# Altium schematic sheet uC.SchDoc: uC
size A3; SheetNumber: 3; SheetTotal: 4
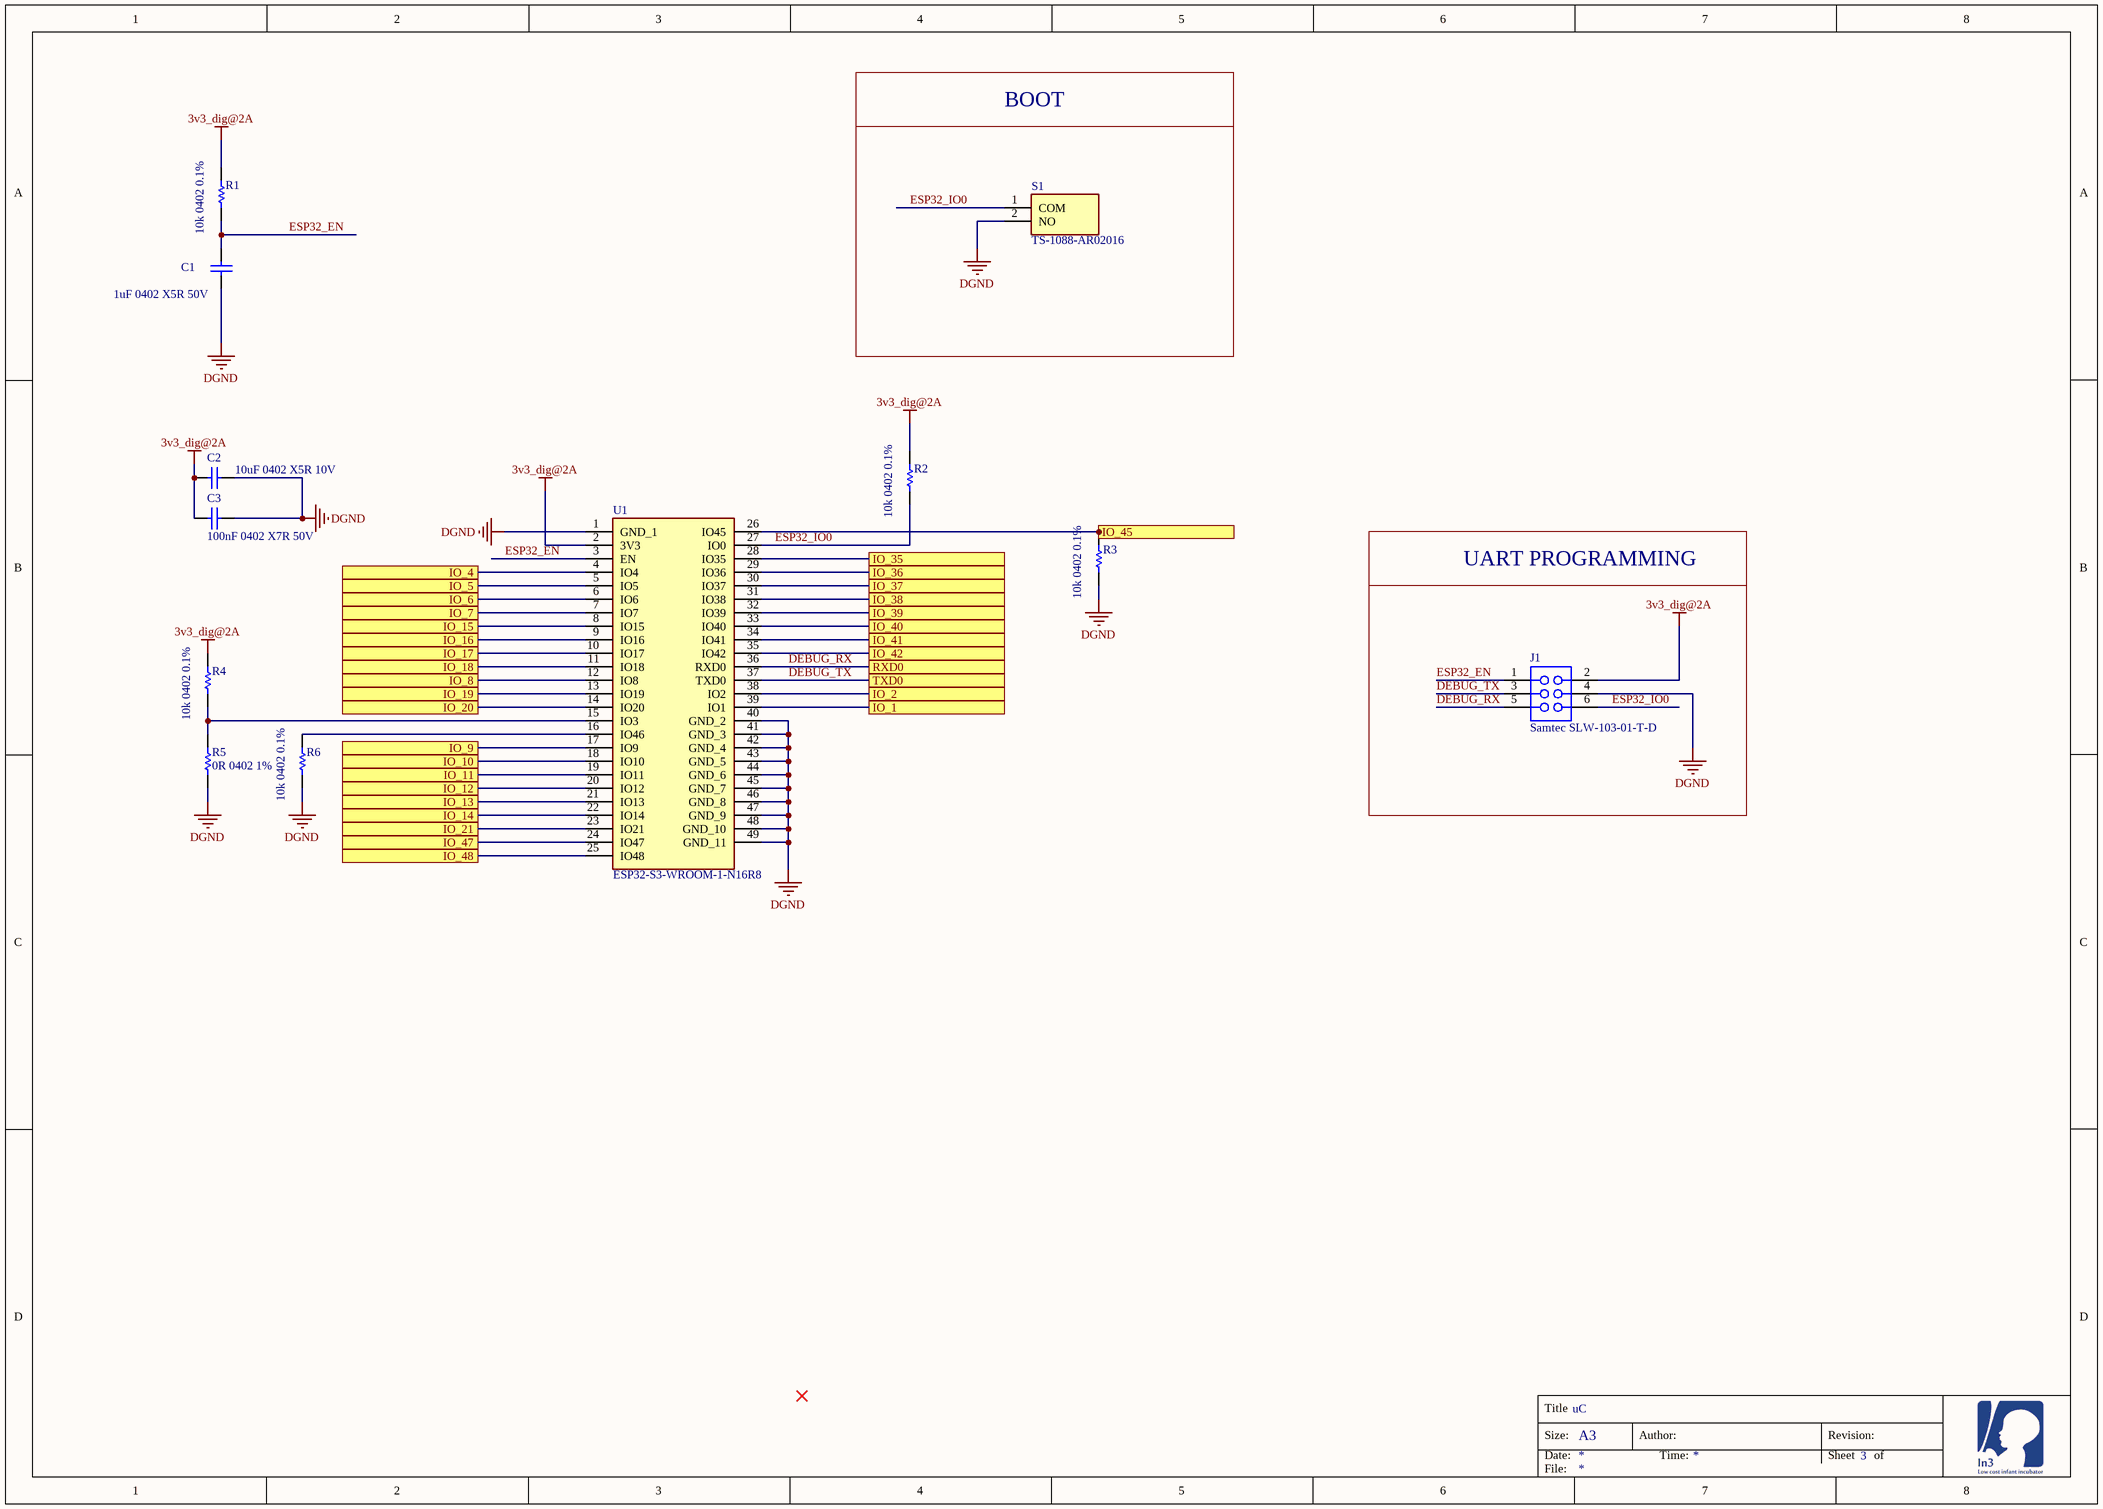
[diagram p0: uC.SchDoc]

## Parts
C1  1uF 0402 X5R 50V  [CAPC1005X55X25NL5T10]
C2  10uF 0402 X5R 10V  [CAPC1005X55X25NL5T10]
C3  100nF 0402 X7R 50V  [CAPC1005X55X25NL5T10]
J1  Samtec SLW-103-01-T-D  [PCB-37z8hw1ej4f71bosen9e-1]
R1  10k 0402 0.1%  [RESC1005X40X25ML05T10]
R2  10k 0402 0.1%  [RESC1005X40X25ML05T10]
R3  10k 0402 0.1%  [RESC1005X40X25ML05T10]
R4  10k 0402 0.1%  [RESC1005X40X25ML05T10]
R5  0R 0402 1%  [RESC1005X40X25ML05T10]
R6  10k 0402 0.1%  [RESC1005X40X25ML05T10]
S1  TS-1088-AR02016  [TS1088AR02016]
U1  ESP32-S3-WROOM-1-N16R8  [ESP32S3WROOM1N16R8]

## Blocks framed on the sheet
BOOT: S1
UART PROGRAMMING: J1

## Ports
IO_1, IO_2, IO_4, IO_5, IO_6, IO_7, IO_8, IO_9, IO_10, IO_11, IO_12, IO_13, IO_14, IO_15, IO_16, IO_17, IO_18, IO_19, IO_20, IO_21, IO_35, IO_36, IO_37, IO_38, IO_39, IO_40, IO_41, IO_42, IO_45, IO_47, IO_48, RXD0, TXD0

## Nets
3v3_dig@2A: C2.2 C3.2 J1.2 R1.2 R2.2 R4.2 U1.2(3V3)
DGND: C1.1 C2.1 C3.1 J1.4 R3.1 R5.2 R6.1 S1.2(NO) U1.1(GND_1) U1.40(GND_2) U1.41(GND_3) U1.42(GND_4) U1.43(GND_5) U1.44(GND_6) U1.45(GND_7) U1.46(GND_8) U1.47(GND_9) U1.48(GND_10) U1.49(GND_11)
DEBUG_RX: J1.5 U1.36(RXD0) ; port RXD0
DEBUG_TX: J1.3 U1.37(TXD0) ; port TXD0
ESP32_EN: C1.2 J1.1 R1.1 U1.3(EN)
ESP32_IO0: J1.6 R2.1 S1.1(COM) U1.27(IO0)
IO_1: U1.39(IO1) ; port IO_1
IO_2: U1.38(IO2) ; port IO_2
IO_4: U1.4(IO4) ; port IO_4
IO_5: U1.5(IO5) ; port IO_5
IO_6: U1.6(IO6) ; port IO_6
IO_7: U1.7(IO7) ; port IO_7
IO_8: U1.12(IO8) ; port IO_8
IO_9: U1.17(IO9) ; port IO_9
IO_10: U1.18(IO10) ; port IO_10
IO_11: U1.19(IO11) ; port IO_11
IO_12: U1.20(IO12) ; port IO_12
IO_13: U1.21(IO13) ; port IO_13
IO_14: U1.22(IO14) ; port IO_14
IO_15: U1.8(IO15) ; port IO_15
IO_16: U1.9(IO16) ; port IO_16
IO_17: U1.10(IO17) ; port IO_17
IO_18: U1.11(IO18) ; port IO_18
IO_19: U1.13(IO19) ; port IO_19
IO_20: U1.14(IO20) ; port IO_20
IO_21: U1.23(IO21) ; port IO_21
IO_35: U1.28(IO35) ; port IO_35
IO_36: U1.29(IO36) ; port IO_36
IO_37: U1.30(IO37) ; port IO_37
IO_38: U1.31(IO38) ; port IO_38
IO_39: U1.32(IO39) ; port IO_39
IO_40: U1.33(IO40) ; port IO_40
IO_41: U1.34(IO41) ; port IO_41
IO_42: U1.35(IO42) ; port IO_42
IO_45: R3.2 U1.26(IO45) ; port IO_45
IO_47: U1.24(IO47) ; port IO_47
IO_48: U1.25(IO48) ; port IO_48
NetR4_1: R4.1 R5.1 U1.15(IO3)
NetR6_2: R6.2 U1.16(IO46)

## Notes on the sheet
- Title
- Size:
- Date:
- A3
- Author:
- Time:
- Revision:
- Sheet
- of
- File:

## Library data of the parts
C1-C3 = CMP-1662-00020-1: ComponentLink2Description: Datasheet; ComponentLink2URL: http://psearch.en.murata.com/capacitor/product/GRM155R60J105KE19%23.pdf; ComponentLink1Description: Manufacturer URL; ComponentLink1URL: http://www.murata.com/
  C1: LCSC_PN: C1518208
  C2: LCSC_PN: C77000
  C3: LCSC_PN: C77020
J1 = CMP-bcf575fbeff46332-1: Dual Row Connector Female Samtec SLW-103-01-T-D; Lead-Free Status: Lead Free; Number of Contacts: 6; Pin Pitch: 2.54 mm; Voltage Rating (AC): 400 V; Gender: Female; Color: Black; Octopart URL: https://octopart.com/slw-103-01-t-d-samtec-292455; Mounting Style: Through Hole, Vertical; Contact Plating: Tin; OctopartID: bcf575fbeff46332; Operating Temperature: 105 °C (max); Size-Width: 4.95 mm; Housing Material: Plastic; Size-Length: 7.62 mm; Number of Rows: 2; Size-Height: 4.57 mm; Packaging: Tube; RoHS: Compliant; Contact Material: Phosphor Bronze; Number of Positions: 6; Housing Color: Black; REACH SVHC Compliance: No SVHC; Manufacturer Part Number: SLW-103-01-T-D; LCSC_PN: C492420
R1-R6 = CMP-2002-07472-1
  R1-R4 R6: LCSC_PN: C190095
  R5: LCSC_PN: C60485
S1 = TS-1088-AR02016: Switch; Manufacturer_Name: XUNPU; Datasheet Link: https://www.xunpudianzi.com/uploads/pdf/TS-1088-ARXXX.pdf; Height: 2mm; Manufacturer_Part_Number: TS-1088-AR02016; LCSC_PN: C720477
U1 = ESP32-S3-WROOM-1-N16R8: Integrated Circuit; Manufacturer_Name: Espressif Systems; Datasheet Link: https://www.espressif.com/sites/default/files/documentation/esp32-s3-wroom-1_wroom-1u_datasheet_en.pdf; Height: 3.25mm; Manufacturer_Part_Number: ESP32-S3-WROOM-1-N16R8; Mouser Part Number: 356-ESP32S3WRM1N16R8; Mouser Price/Stock: https://www.mouser.co.uk/ProductDetail/Espressif-Systems/ESP32-S3-WROOM-1-N16R8?qs=Li%252BoUPsLEnvQc9gW6AMhZg%3D%3D; LCSC_PN: C2913202